# EAGLE design LightingUPS_v2a (EAGLE 7.5.0)
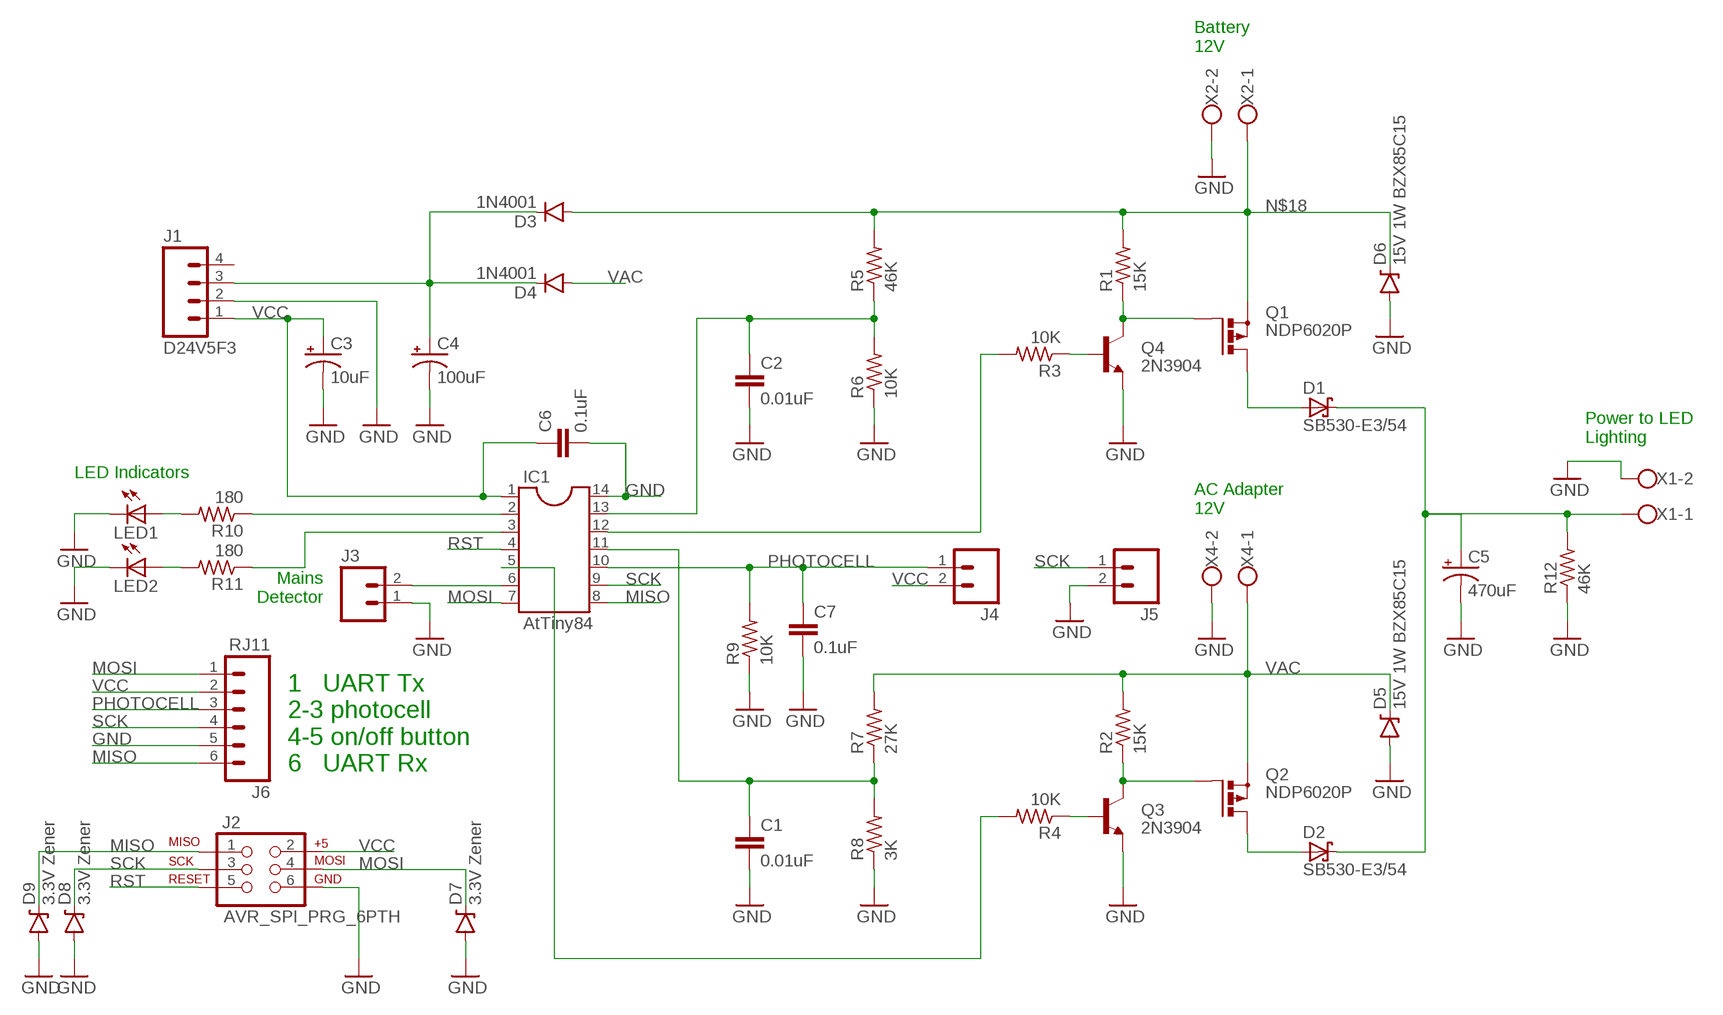
[diagram p0: schematic, sheet 1]

## Parts
C1  0.01uF  CAPPTH1  [CAP-PTH-5MM]
C2  0.01uF  CAPPTH1  [CAP-PTH-5MM]
C3  10uF  CAP_POLPTH1  [CPOL-RADIAL-100UF-25V]
C4  100uF  CAP_POLPTH1  [CPOL-RADIAL-100UF-25V]
C5  470uF  CAP_POLPTH4  [CPOL-RADIAL-1000UF-25V]
C6  0.1uF  CAPPTH  [CAP-PTH-SMALL]
C7  0.1uF  CAPPTH  [CAP-PTH-SMALL]
D1  SB530-E3/54  SCHOTTKY-DIODEDO201T15  [DO201T15]
D2  SB530-E3/54  SCHOTTKY-DIODEDO201T15  [DO201T15]
D3  1N4001  DIODEPTH  [DIODE-1N4001]
D4  1N4001  DIODEPTH  [DIODE-1N4001]
D5  15V 1W BZX85C15  DIODE-ZENERPTH  [DIODE-ZENER]
D6  15V 1W BZX85C15  DIODE-ZENERPTH  [DIODE-ZENER]
D7  3.3V Zener  DIODE-ZENERPTH  [DIODE-ZENER]
D8  3.3V Zener  DIODE-ZENERPTH  [DIODE-ZENER]
D9  3.3V Zener  DIODE-ZENERPTH  [DIODE-ZENER]
IC1  AtTiny84  DIL14  [DIL14]
J1  D24V5F3  M04PTH  [1X04]
J2  AVR_SPI_PRG_6PTH  [2X3]
J3  M02PTH  [1X02]
J4  M02PTH  [1X02]
J5  M02PTH  [1X02]
J6  RJ11  RJ11-6PTH  [RJ11-6]
LED1  LED5MM  [LED5MM]
LED2  LED5MM  [LED5MM]
Q1  NDP6020P  PMOSFET_PTO220BV  [TO220BV]
Q2  NDP6020P  PMOSFET_PTO220BV  [TO220BV]
Q3  2N3904  TRANSISTOR_NPNTO-92-AMMO  [TO-92-AMMO]
Q4  2N3904  TRANSISTOR_NPNTO-92-AMMO  [TO-92-AMMO]
R1  15K  R-US_0204/5  [0204/5]
R2  15K  R-US_0204/5  [0204/5]
R3  10K  R-US_0204/5  [0204/5]
R4  10K  R-US_0204/5  [0204/5]
R5  46K  R-US_0204/5  [0204/5]
R6  10K  R-US_0204/5  [0204/5]
R7  27K  R-US_0204/5  [0204/5]
R8  3K  R-US_0204/5  [0204/5]
R9  10K  R-US_0204/5  [0204/5]
R10  180  R-US_0204/5  [0204/5]
R11  180  R-US_0204/5  [0204/5]
R12  46K  R-US_0204/5  [0204/5]
X1  W237-102  [W237-102]
X2  W237-102  [W237-102]
X4  W237-102  [W237-102]

## Nets
GND: C1.2 C2.2 C3.2(-) C4.2(-) C5.- C6.2 C7.2 D5.P$2(A) D6.P$2(A) D7.P$2(A) D8.P$2(A) D9.P$2(A) IC1.14 J1.2 J2.6 J3.1 J5.2 J6.5 LED1.K(C) LED2.K(C) Q3.1(E) Q4.1(E) R6.1 R8.1 R9.1 R12.1 X1.2 X2.2 X4.2
MISO: D9.P$1(C) IC1.8 J2.1 J6.6
MOSI: D7.P$1(C) IC1.7 J2.4 J6.1
N$1: LED1.A R10.2
N$2: Q1.G Q4.3(C) R1.1
N$3: Q4.2(B) R3.1
N$4: D1.A Q1.D
N$5: C5.+ D1.C D2.C R12.2 X1.1
N$6: C2.1 IC1.13 R5.1 R6.2
N$7: IC1.6 J3.2
N$8: C1.1 IC1.11 R7.1 R8.2
N$9: Q2.G Q3.3(C) R2.1
N$10: Q3.2(B) R4.1
N$11: D2.A Q2.D
N$12: IC1.12 R3.2
N$13: C4.1(+) D3.C D4.C J1.3
N$14: IC1.5 R4.2
N$15: IC1.2 R10.1
N$16: IC1.3 R11.1
N$17: LED2.A R11.2
N$18: D3.A D6.P$1(C) Q1.S R1.2 R5.2 X2.1
PHOTOCELL: C7.1 IC1.10 J4.1 J6.3 R9.2
RST: IC1.4 J2.5
SCK: D8.P$1(C) IC1.9 J2.3 J5.1 J6.4
VAC: D4.A D5.P$1(C) Q2.S R2.2 R7.2 X4.1
VCC: C3.1(+) C6.1 IC1.1 J1.1 J2.2 J4.2 J6.2
Unconnected: J1.4

## Notes on the sheet
- Battery
  12V
- Power to LED
  Lighting
- LED Indicators
- AC Adapter
  12V
- Mains
  Detector
- 1   UART Tx
  2-3 photocell
  4-5 on/off button
  6   UART Rx

## Library data of the parts
C1 C2 = SparkFun-Passives:CAP: Capacitor Standard 0603 ceramic capacitor, and 0.1" leaded capacitor.
C3-C5 = SparkFun-Capacitors:CAP_POL: Capacitor Polarized These are standard SMD and PTH capacitors. Normally 10uF, 47uF, and 100uF in electrolytic and tantalum varieties. Always verify the external diameter of the through hole cap, it varies with capacity, voltage, and manufacturer. The EIA devices should be standard.
C6 C7 = SparkFun-Capacitors:CAP: Capacitor Standard 0603 ceramic capacitor, and 0.1" leaded capacitor.
D1 D2 = adafruit:SCHOTTKY-DIODE: Schottky Diode
D3 D4 = SparkFun-DiscreteSemi:DIODE: Diode These are standard reverse protection diodes and small signal diodes. SMA package can handle up to about 1A. SOD-323 can handle about 200mA. What the SOD-323 package when ordering, there are some mfgs out there that are 5-pin packages.
D5-D9 = SparkFun-DiscreteSemi:DIODE-ZENER: Zener Diode Production Part - 8199 3.4V Zener Voltage
IC1 = ic-package:DIL14: Dual In Line / Socket
J1 = SparkFun-Connectors:M04: Header 4 Standard 4-pin 0.1" header. Use with straight break away headers (SKU : PRT-00116), right angle break away headers (PRT-00553), swiss pins (PRT-00743), machine pins (PRT-00117), and female headers (PRT-00115). Molex polarized connector foot print use with SKU : PRT-08231 with associated crimp pins and housings. 1MM SMD Version SKU: PRT-10208; PROD_ID: CONN-09696
J2 = SparkFun-Connectors:AVR_SPI_PRG_6: AVR ISP 6 Pin This is the reduced ISP connector for AVR programming. Common on Arduino. This footprint will take up less PCB space and can be used with a 10-pin to 6-pin adapter such as SKU: BOB-08508 **Special note about "TEST_POINT" package. The stop mask is on the top side, so if you want your programming test points to be on the bottom of your board, make sure to place this package on the bottom side of the board. This also ensure that the orientation to program from the bottom side will be correct.
J3-J5 = SparkFun-Connectors:M02: Standard 2-pin 0.1" header. Use with - straight break away headers ( PRT-00116) - right angle break away headers (PRT-00553) - swiss pins (PRT-00743) - machine pins (PRT-00117) - female headers (PRT-00115) Molex polarized connector foot print use with: PRT-08233 with associated crimp pins and housings. 2.54_SCREWTERM for use with PRT-10571. 3.5mm Screw Terminal footprints for PRT-08084 5mm Screw Terminal footprints for use with PRT-08432
J6 = SparkFun-Connectors:RJ11-6: RJ11 Jack Simple 6 pin RJ11 jack. Commonly found on CAT3 devices and Microchip programmers. SKU: PRT-00132; PROD_ID: CONN-08590
LED1 LED2 = adafruit:LED: LED OSRAM: - CHIPLED LG R971, LG N971, LY N971, LG Q971, LY Q971, LO R971, LY R971 LH N974, LH R974 LS Q976, LO Q976, LY Q976 LO Q996 - Hyper CHIPLED LW Q18S LB Q993, LB Q99A, LB R99A - SideLED LS A670, LO A670, LY A670, LG A670, LP A670 LB A673, LV A673, LT A673, LW A673 LH A674 LY A675 LS A676, LA A676, LO A676, LY A676, LW A676 LS A679, LY A679, LG A679 - Hyper Micro SIDELED® LS Y876, LA Y876, LO Y876, LY Y876 LT Y87S - SmartLED LW L88C, LW L88S LB L89C, LB L89S, LG L890 LS L89K, LO L89K, LY L89K LS L896, LA L896, LO L896, LY L896 - TOPLED LS T670, LO T670, LY T670, LG T670, LP T670 LSG T670, LSP T670, LSY T670, LOP T670, LYG T670 LG T671, LOG T671, LSG T671 LB T673, LV T673, LT T673, LW T673 LH T674 LS T676, LA T676, LO T676, LY T676, LB T676, LH T676, LSB T676, LW T676 LB T67C, LV T67C, LT T67C, LS T67K, LO T67K, LY T67K, LW E67C LS E67B, LA E67B, LO E67B, LY E67B, LB E67C, LV E67C, LT E67C LW T67C LS T679, LY T679, LG T679 LS T770, LO T770, LY T770, LG T770, LP T770 LB T773, LV T773, LT T773, LW T773 LH T774 LS E675, LA E675, LY E675, LS T675 LS T776, LA T776, LO T776, LY T776, LB T776 LHGB T686 LT T68C, LB T68C - Hyper Mini TOPLED® LB M676 - Mini TOPLED Santana® LG M470 LS M47K, LO M47K, LY M47K Source: http://www.osram.convergy.de/
Q1 Q2 = transistor-power:PMOSFET_P: Power MOSFET P-Channel
Q3 Q4 = SparkFun-DiscreteSemi:TRANSISTOR_NPN: Generic NPN BJT MMBT2222A - TRANS-08049 (SOT-23, 1A 40V) MPSA42 - TRANS-09116 (SOT-23, 500mA 300V) MMBT5088LT1G - TRANS-11160 (SOT-23, 50 mA 30V) BC547 - COM-08928 <http://www.sparkfun.com/products/8928> (TO-92 45V 100mA) (1.Collector 2.Base 3.Emitter) 2N3904 - COM-00521 <http://www.sparkfun.com/products/521> (TO-92 40V 200mA) (1.Emitter 2.Base 3.Collector) P2N2222A - COM-12852 <http://www.sparkfun.com/products/12852> (TO-92 40V 600mA) (1.Collector 2.Base 3.Emitter)
R1-R12 = resistor:R-US_: RESISTOR, American symbol
X1 X2 X4 = con-wago-500:W237-102: WAGO SCREW CLAMP; MPN: 237-102; OC_FARNELL: unknown; OC_NEWARK: 70K9898

## Board
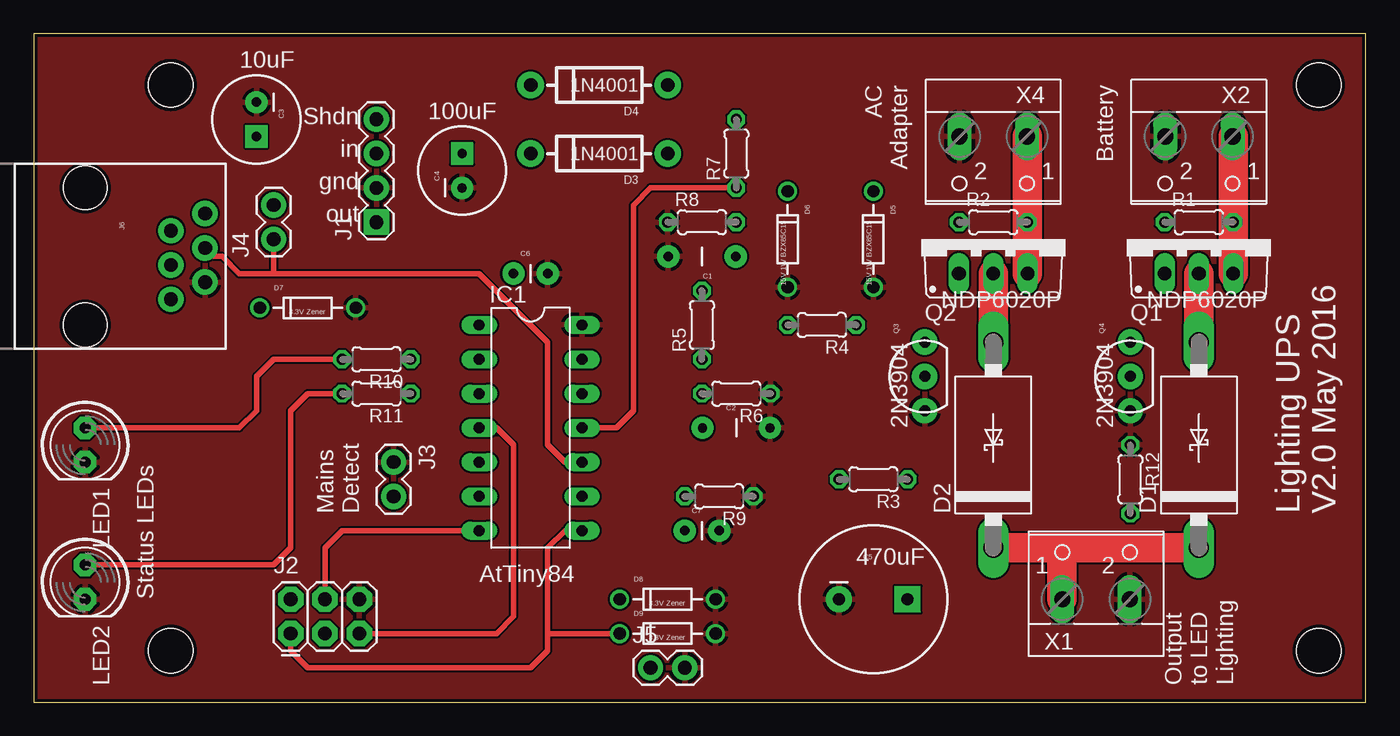
[diagram p1: board, top side]
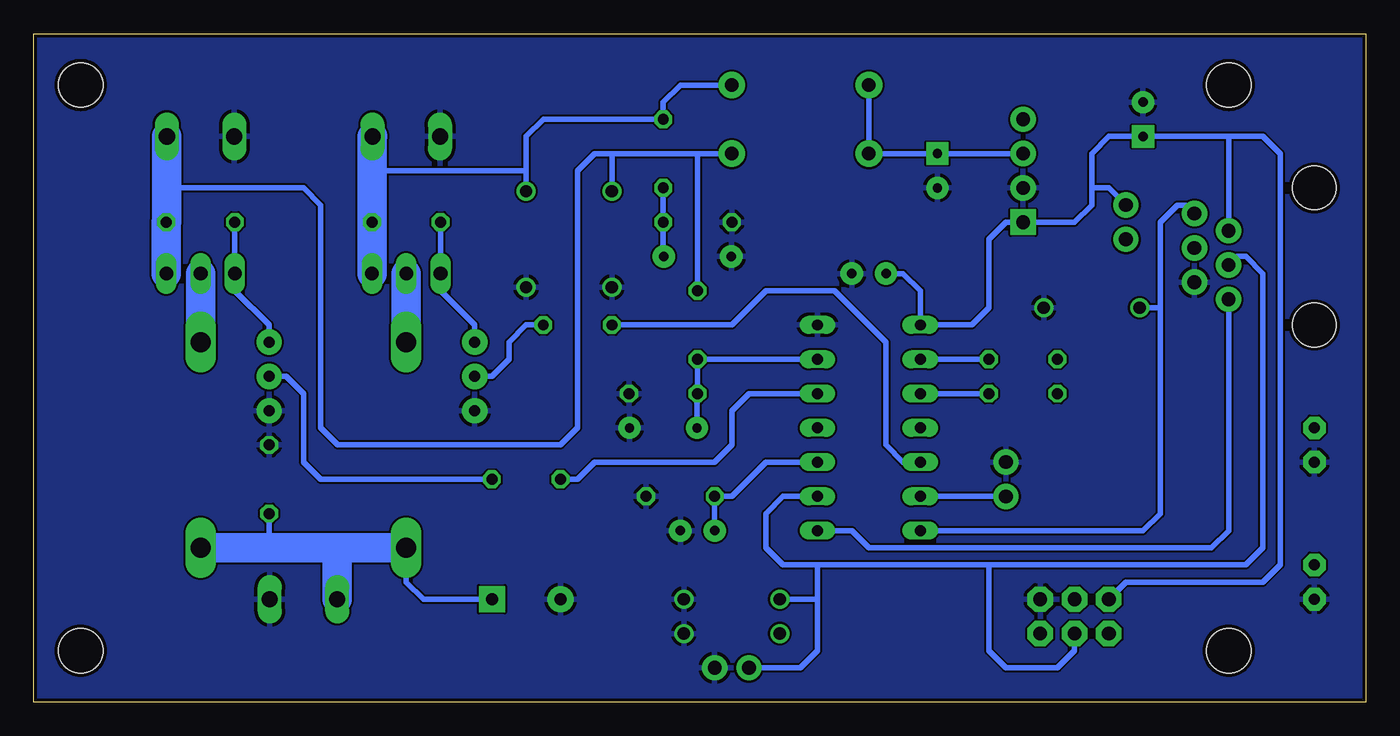
[diagram p2: board, bottom side, seen from below]

Size 98.73 x 49.52 mm. Coordinates in mm from the lower left corner, seen from the top.
Outline: 0,0 98.73,0 98.73,49.52 0,49.52 0,0
Copper layers (1*16): Top 0.035mm / dielectric 1.5mm / Bottom 0.035mm
Design rules "SeeedStudio_2layer_DRU_no_angle_20140221": minimum track width 6mil, minimum drill 12mil, track to track 6mil, track to pad 6mil, pad to pad 6mil, via to via 6mil, smd to smd 0mil, copper to edge 10mil, drill to drill 10mil, minimum pad ring 10mil, minimum via ring 6mil, stop-mask expansion 2mil, vias tented up to drill 100mil, thermal gap 10mil

### Footprints (pad centres in the part's own frame; a part is rotated, then mirrored left to right if it is on the bottom)
CAP-PTH-5MM = drill 0.7 pad 1.651: 1 -2.5,0; 2 2.5,0
CPOL-RADIAL-100UF-25V = drill 0.7 pad 1.651 square: 1 1.27,0 | drill 0.7 pad 1.651: 2 -1.27,0
CPOL-RADIAL-1000UF-25V = drill 0.9 pad 1.93 square: + 2.54,0 | drill 0.9 pad 1.93: - -2.54,0
CAP-PTH-SMALL = drill 0.7 pad 1.651: 1 0,0; 2 2.54,0
DO201T15 = drill 1.499 long: A 7.62,0; C -7.62,0
DIODE-1N4001 = drill 1 pad 1.981: A -5.08,0; C 5.08,0
DIODE-ZENER = drill 0.9: P$1 -3.556,0; P$2 3.556,0
DIL14 = drill 0.813 long: 1 -7.62,-3.81; 2 -5.08,-3.81; 3 -2.54,-3.81; 4 0,-3.81; 5 2.54,-3.81; 6 5.08,-3.81; 7 7.62,-3.81; 8 7.62,3.81; 9 5.08,3.81; 10 2.54,3.81; 11 0,3.81; 12 -2.54,3.81; 13 -5.08,3.81; 14 -7.62,3.81
1X04 = drill 1.016 pad 1.88 square: 1 0,0 | drill 1.016 pad 1.88: 2 2.54,0; 3 5.08,0; 4 7.62,0
2X3 = drill 1.016 pad 1.88 octagon: 1 0,0; 2 0,2.54; 3 2.54,0; 4 2.54,2.54; 5 5.08,0; 6 5.08,2.54
1X02 = drill 1.016 pad 1.88: 1 0,0; 2 2.54,0
RJ11-6 = drill 1.016 pad 1.88: 1 -3.175,8.89; 2 -1.905,6.35; 3 -0.635,8.89; 4 0.635,6.35; 5 1.905,8.89; 6 3.175,6.35 | hole 3.251: -5.08,0; 5.08,0
LED5MM = drill 0.813 pad 1.676 octagon: A -1.27,0; K 1.27,0
TO220BV = drill 1.016 long: D 0,-2.54; G -2.54,-2.54; S 2.54,-2.54
TO-92-AMMO = drill 0.813 pad 1.88: 1 -2.54,0; 2 0,0; 3 2.54,0
0204/5 = drill 0.813 octagon: 1 -2.54,0; 2 2.54,0
STAND-OFF = hole 3.302: 0,0
W237-102 = drill 1.194 long: 1 -2.5,-1.27; 2 2.5,-1.27

### Placement (x,y rotation side)
C1  49.53,33.02 180 top
C2  52.07,20.32 0 top
C3  16.51,43.18 270 top
C4  31.75,39.37 90 top
C5  62.23,7.62 0 top
C6  35.56,31.75 0 top
C7  48.26,12.7 0 top
D1  86.36,19.05 90 top
D2  71.12,19.05 90 top
D3  41.91,40.64 180 top
D4  41.91,45.72 180 top
D5  62.23,34.29 270 top
D6  55.88,34.29 270 top
D7  20.32,29.21 0 top
D8  46.99,7.62 0 top
D9  46.99,5.08 0 top
IC1  36.83,20.32 270 top
J1  25.4,35.56 90 top
J2  19.05,5.08 0 top
J3  26.67,17.78 270 top
J4  17.78,34.29 90 top
J5  45.72,2.54 0 top
J6  3.81,33.02 270 top
LED1  3.81,19.05 270 top
LED2  3.81,8.89 270 top
Q1  86.36,34.29 0 top
Q2  71.12,34.29 0 top
Q3  66.04,24.13 90 top
Q4  81.28,24.13 90 top
R1  86.36,35.56 0 top
R2  71.12,35.56 0 top
R3  62.23,16.51 180 top
R4  58.42,27.94 180 top
R5  49.53,27.94 90 top
R6  52.07,22.86 180 top
R7  52.07,40.64 90 top
R8  49.53,35.56 0 top
R9  50.8,15.24 180 top
R10  25.4,25.4 180 top
R11  25.4,22.86 180 top
R12  81.28,16.51 270 top
U$1  [STAND-OFF]  10.16,3.81 0 top
U$2  [STAND-OFF]  95.25,3.81 0 top
U$3  [STAND-OFF]  10.16,45.72 0 top
U$4  [STAND-OFF]  95.25,45.72 0 top
X1  78.74,8.89 0 top
X2  86.36,40.64 180 top
X4  71.12,40.64 180 top

### Tracks (layer width: path | path; a pad name or v marks a point on that pad's centre or on a via)
GND
  pour Bottom: 0,0 0,49.53 99.06,49.53 99.06,0
  pour Top: 0,0 0,49.53 99.06,49.53 99.06,0
MISO
  Top 0.406: J2.1 19.05,3.81 20.32,2.54 36.83,2.54 38.1,3.81 38.1,5.08 | 38.1,5.08 38.1,11.43 39.37,12.7 IC1.8 | D9.P$1 38.1,5.08
  Bottom 0.406: IC1.8 38.1,12.7 36.83,11.43 11.43,11.43 10.16,12.7 J6.6
MOSI
  Top 0.406: J2.4 21.59,11.43 22.86,12.7 IC1.7
  Bottom 0.406: IC1.7 16.51,12.7 15.24,13.97 15.24,29.21 | 15.24,29.21 15.24,35.56 13.97,36.83 13.34,36.83 J6.1 | D7.P$1 15.24,29.21
N$1
  Top 0.406: R10.2 17.78,25.4 16.51,24.13 16.51,21.59 15.24,20.32 LED1.A
N$2
  Bottom 0.406: Q4.3 81.28,27.94 83.82,30.48 Q1.G R1.1
N$3
  Bottom 0.406: R3.1 77.47,16.51 78.74,17.78 78.74,22.86 80.01,24.13 Q4.2
N$4
  Top 2.184: Q1.D D1.A
  Bottom 2.184: D1.A Q1.D
N$5
  Top 2.184: D2.C 76.2,11.43 | 76.2,11.43 D1.C | 76.2,7.62 76.2,11.43
  Bottom 0.406: C5.+ 69.85,7.62 71.12,8.89 D2.C | R12.2 81.28,11.43
  Bottom 2.184: D2.C 76.2,11.43 | 76.2,11.43 81.28,11.43 D1.C | X1.1 76.24,11.39 76.2,11.43
N$6
  Bottom 0.406: IC1.13 R5.1 R6.2 49.57,22.86 C2.1
N$7
  Bottom 0.406: IC1.6 J3.2
N$8
  Top 0.406: IC1.11 43.18,20.32 44.45,21.59 44.45,36.83 45.72,38.1 R7.1
  Bottom 0.406: R7.1 R8.2 52.07,33.12 arc-45 C1.1 arc-45 52.07,32.92
N$9
  Bottom 0.406: Q3.3 66.04,27.94 68.58,30.48 Q2.G R2.1
N$10
  Bottom 0.406: R4.1 62.23,27.94 63.5,26.67 63.5,25.4 64.77,24.13 Q3.2
N$11
  Top 2.184: Q2.D D2.A
  Bottom 2.184: Q2.D D2.A
N$12
  Bottom 0.406: IC1.12 45.72,22.86 46.99,21.59 46.99,19.05 48.26,17.78 57.15,17.78 58.42,16.51 R3.2
N$13
  Bottom 0.406: J1.3 C4.1 D3.C D4.C
N$14
  Bottom 0.406: IC1.5 34.29,17.78 35.56,19.05 35.56,26.67 39.37,30.48 44.45,30.48 46.99,27.94 R4.2
N$15
  Bottom 0.406: IC1.2 R10.1
N$16
  Bottom 0.406: R11.1 IC1.3
N$17
  Top 0.406: R11.2 20.32,22.86 19.05,21.59 19.05,11.43 17.78,10.16 LED2.A
N$18
  Top 2.184: 88.9,41.91 Q1.S
  Bottom 0.406: D3.A 49.53,40.64 | 88.86,38.1 78.74,38.1 77.47,36.83 77.47,20.32 76.2,19.05 59.69,19.05 58.42,20.32 58.42,39.37 57.15,40.64 55.88,40.64 | R5.2 49.53,40.64 | 49.53,40.64 55.88,40.64 | D6.P$1 55.88,40.64
  Bottom 2.184: Q1.S R1.2 88.86,35.6 88.86,38.1 X2.1
PHOTOCELL
  Top 0.406: IC1.10 39.37,17.78 38.1,19.05 38.1,26.67 33.02,31.75 17.78,31.75 | 17.78,31.75 15.24,31.75 13.97,33.02 13.34,33.02 J6.3 | J4.1 17.78,31.75
  Bottom 0.406: IC1.10 44.45,17.78 46.99,15.24 R9.2 C7.1
RST
  Top 0.406: IC1.4 34.29,20.32 35.56,19.05 35.56,6.35 34.29,5.08 J2.5
SCK
  Bottom 0.406: IC1.9 43.18,15.24 44.45,13.97 44.45,11.43 43.18,10.16 40.64,10.16 | 40.64,10.16 27.94,10.16 | 27.94,10.16 8.89,10.16 7.62,11.43 7.62,31.75 8.89,33.02 9.53,33.02 J6.4 | J2.3 21.59,3.81 22.86,2.54 26.67,2.54 27.94,3.81 27.94,10.16 | J5.1 41.91,2.54 40.64,3.81 40.64,7.62 | 40.64,7.62 40.64,10.16 | D8.P$1 40.64,7.62
VAC
  Top 2.184: Q2.S 73.66,41.91
  Bottom 0.406: D4.A 50.8,45.72 52.07,44.45 R7.2 60.96,43.18 62.23,41.91 62.23,39.37 | 62.23,39.37 D5.P$1 | 62.23,39.37 73.66,39.37
  Bottom 2.184: Q2.S R2.2 73.66,39.37 73.66,41.87 X4.1
VCC
  Bottom 0.406: C6.1 34.29,31.75 33.02,30.48 IC1.1 29.21,27.94 27.94,29.21 27.94,34.29 26.67,35.56 J1.1 21.59,35.56 20.32,36.83 20.32,38.1 | J2.2 17.78,8.89 7.62,8.89 6.35,10.16 6.35,40.64 7.62,41.91 10.16,41.91 | 10.16,41.91 C3.1 19.05,41.91 20.32,40.64 20.32,38.1 | J6.2 10.16,41.91 | J4.2 19.05,38.1 20.32,38.1

### Text on the board
tPlace: 10uF | AC / Adapter | Battery | 100uF | Shdn / in / gnd / out | NDP6020P | NDP6020P | 2N3904 | 2N3904 | Mains / Detect | Lighting UPS / V2.0 May 2016 | AtTiny84 | 470uF | Status LEDs | Output / to LED / Lighting